# Altium project Spider.PrjPcb
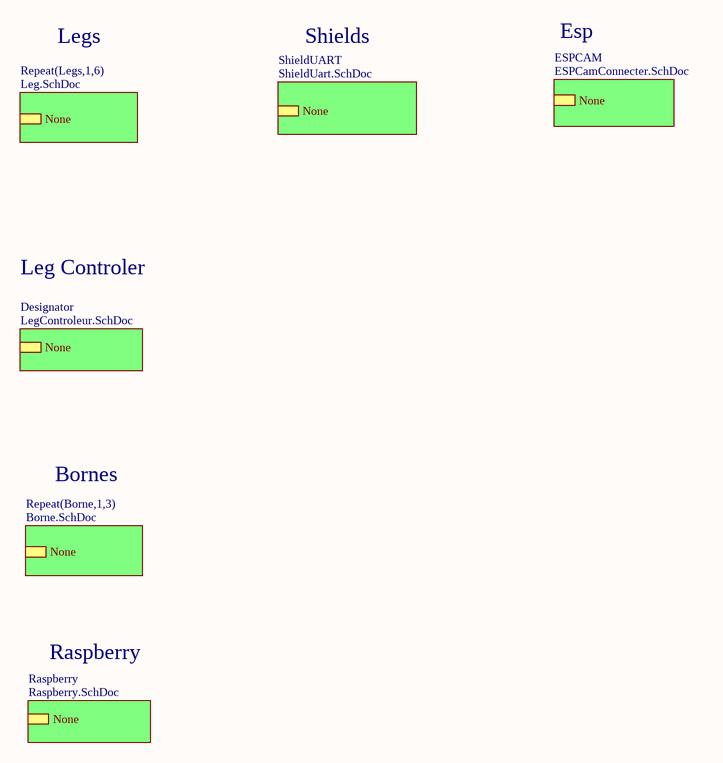
[diagram p0: MainSchema.SchDoc]
4 sheets, 30 parts. Net scope: hierarchical (ports join the sheet entries above them; power ports are global).
Board file: MainPCB.PcbDoc
Sheets:
  MainSchema.SchDoc
    Designator = LegControleur.SchDoc
    Raspberry = Raspberry.SchDoc
    ESPCAM = ESPCamConnecter.SchDoc

## Sheet MainSchema.SchDoc
size A4

### Sub-sheets
Designator = LegControleur.SchDoc: None
ESPCAM = ESPCamConnecter.SchDoc: None
Raspberry = Raspberry.SchDoc: None
Repeat(Borne,1,3) = Borne.SchDoc (file not in this document): None
Repeat(Legs,1,6) = Leg.SchDoc (file not in this document): None
ShieldUART = ShieldUart.SchDoc (file not in this document): None

### Notes on the sheet
- Legs
- Shields
- Esp
- Leg Controler
- Bornes
- Raspberry

## Sheet LegControleur.SchDoc
size A4
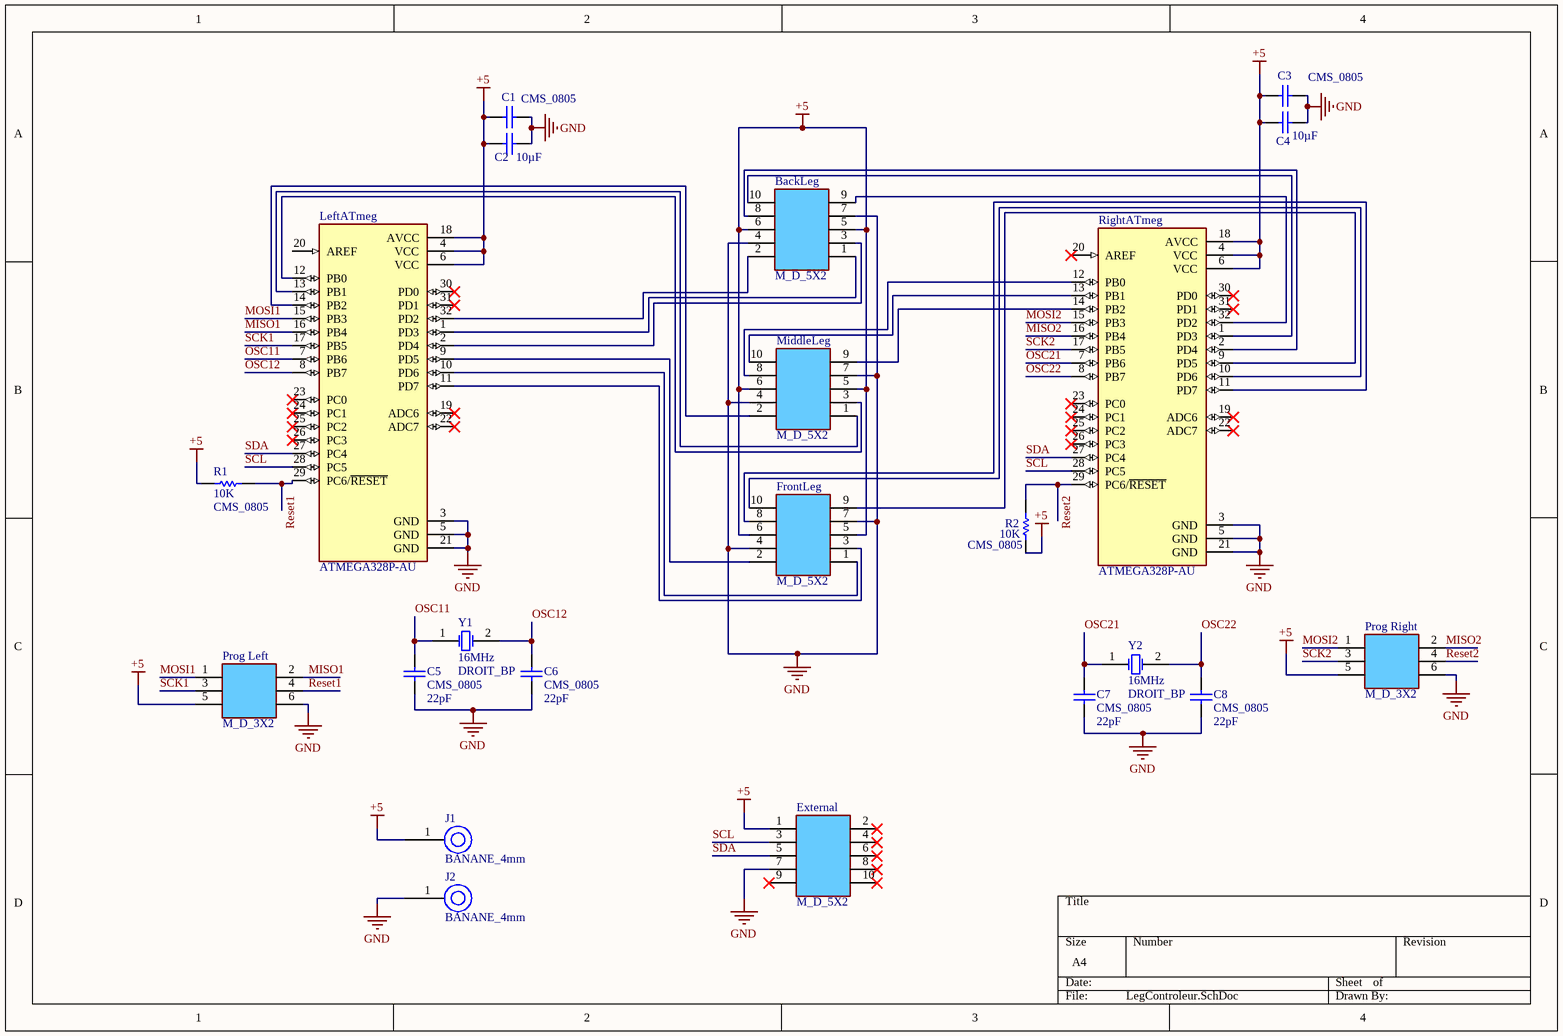
[diagram p1: LegControleur.SchDoc]

### Parts
BackLeg  Type: M_D_5X2  [BARRETTE_5X2_M_D]  (hidden comment: BARRETTE_5 CONTACTS_2 RANGEES_MALE_DROITE)
C1  value 10µF  Type: CMS_0805  [CONDENSATEUR_CMS_0805]  (hidden comment: CMS_0805_AVCC)
C2  CMS_0805_VCC  [CONDENSATEUR_CMS_0805]  (value not drawn)
C3  value 10µF  Type: CMS_0805  [CONDENSATEUR_CMS_0805]  (hidden comment: CMS_0805_AVCC)
C4  CMS_0805_VCC  [CONDENSATEUR_CMS_0805]  (value not drawn)
C5  value 22pF  [CONDENSATEUR_CMS_0805]  (hidden comment: CMS_0805)
C6  value 22pF  [CONDENSATEUR_CMS_0805]  (hidden comment: CMS_0805)
C7  value 22pF  [CONDENSATEUR_CMS_0805]  (hidden comment: CMS_0805)
C8  value 22pF  [CONDENSATEUR_CMS_0805]  (hidden comment: CMS_0805)
External  Type: M_D_5X2  [BARRETTE_5X2_M_D]  (hidden comment: BARRETTE_5 CONTACTS_2 RANGEES_MALE_DROITE)
FrontLeg  Type: M_D_5X2  [BARRETTE_5X2_M_D]  (hidden comment: BARRETTE_5 CONTACTS_2 RANGEES_MALE_DROITE)
J1  Type: BANANE_4mm  [DOUILLE_BANANE_4mm]  (hidden comment: Alim 5v)
J2  Type: BANANE_4mm  [DOUILLE_BANANE_4mm]  (hidden comment: Alim GND)
LeftATmeg  ATMEGA328P-AU  [QFP80P900X900X120-32N]
MiddleLeg  Type: M_D_5X2  [BARRETTE_5X2_M_D]  (hidden comment: BARRETTE_5 CONTACTS_2 RANGEES_MALE_DROITE)
Prog_Left  Type: M_D_3X2  [BARRETTE_3X2_M_D]  (hidden comment: BARRETTE_3 CONTACTS_2 RANGEES_MALE_DROITE)
Prog_Right  Type: M_D_3X2  [BARRETTE_3X2_M_D]  (hidden comment: BARRETTE_3 CONTACTS_2 RANGEES_MALE_DROITE)
R1  value 10K  Type: CMS_0805  [RESISTANCE_CMS_0805]  (hidden comment: RESISTANCE_CMS_0805)
R2  value 10K  Type: CMS_0805  [RESISTANCE_CMS_0805]  (hidden comment: RESISTANCE_CMS_0805)
RightATmeg  ATMEGA328P-AU  [QFP80P900X900X120-32N]
Y1  value 16MHz  Type: DROIT_BP  [QUARTZ_DROIT_BP]  (hidden comment: QUARTZ_DROIT_BAS_PROFIL)
Y2  value 16MHz  Type: DROIT_BP  [QUARTZ_DROIT_BP]  (hidden comment: QUARTZ_DROIT_BAS_PROFIL)

### Nets
+5: BackLeg.5 BackLeg.6 C1.2 C2.2 C3.2 C4.2 External.1 FrontLeg.5 FrontLeg.6 J1.1 LeftATmeg.4(VCC) LeftATmeg.6(VCC) LeftATmeg.18(AVCC) MiddleLeg.5 MiddleLeg.6 Prog_Left.5 Prog_Right.5 R1.1 R2.1 RightATmeg.4(VCC) RightATmeg.6(VCC) RightATmeg.18(AVCC)
GND: BackLeg.4 BackLeg.7 C1.1 C2.1 C3.1 C4.1 C5.1 C6.1 C7.1 C8.1 External.7 FrontLeg.4 FrontLeg.7 J2.1 LeftATmeg.3(GND) LeftATmeg.5(GND) LeftATmeg.21(GND) MiddleLeg.4 MiddleLeg.7 Prog_Left.6 Prog_Right.6 RightATmeg.3(GND) RightATmeg.5(GND) RightATmeg.21(GND)
MISO1: LeftATmeg.16(PB4) Prog_Left.2
MISO2: Prog_Right.2 RightATmeg.16(PB4)
MOSI1: LeftATmeg.15(PB3) Prog_Left.1
MOSI2: Prog_Right.1 RightATmeg.15(PB3)
OSC11: C5.2 LeftATmeg.7(PB6) Y1.1(OSC1)
OSC12: C6.2 LeftATmeg.8(PB7) Y1.2(OSC2)
OSC21: C7.2 RightATmeg.7(PB6) Y2.1(OSC1)
OSC22: C8.2 RightATmeg.8(PB7) Y2.2(OSC2)
Reset1: LeftATmeg.29(PC6/~{RESET}) Prog_Left.4 R1.2
Reset2: Prog_Right.4 R2.2 RightATmeg.29(PC6/~{RESET})
SCK1: LeftATmeg.17(PB5) Prog_Left.3
SCK2: Prog_Right.3 RightATmeg.17(PB5)
SCL: External.3 LeftATmeg.28(PC5) RightATmeg.28(PC5)
SDA: External.5 LeftATmeg.27(PC4) RightATmeg.27(PC4)
NetBackLeg_1: BackLeg.1 LeftATmeg.1(PD3)
NetBackLeg_2: BackLeg.2 LeftATmeg.32(PD2)
NetBackLeg_3: BackLeg.3 LeftATmeg.2(PD4)
NetBackLeg_8: BackLeg.8 RightATmeg.2(PD4)
NetBackLeg_9: BackLeg.9 RightATmeg.32(PD2)
NetBackLeg_10: BackLeg.10 RightATmeg.1(PD3)
NetFrontLeg_1: FrontLeg.1 LeftATmeg.10(PD6)
NetFrontLeg_2: FrontLeg.2 LeftATmeg.9(PD5)
NetFrontLeg_3: FrontLeg.3 LeftATmeg.11(PD7)
NetFrontLeg_8: FrontLeg.8 RightATmeg.11(PD7)
NetFrontLeg_9: FrontLeg.9 RightATmeg.9(PD5)
NetFrontLeg_10: FrontLeg.10 RightATmeg.10(PD6)
NetLeftATmeg_12: LeftATmeg.12(PB0) MiddleLeg.3
NetLeftATmeg_13: LeftATmeg.13(PB1) MiddleLeg.1
NetLeftATmeg_14: LeftATmeg.14(PB2) MiddleLeg.2
NetMiddleLeg_8: MiddleLeg.8 RightATmeg.12(PB0)
NetMiddleLeg_9: MiddleLeg.9 RightATmeg.14(PB2)
NetMiddleLeg_10: MiddleLeg.10 RightATmeg.13(PB1)

Not connected (* = marked no-connect by the designer): External 2* 4* 6* 8* 9* 10*; LeftATmeg 19(ADC6)* 20(AREF) 22(ADC7)* 23(PC0)* 24(PC1)* 25(PC2)* 26(PC3)* 30(PD0)* 31(PD1)*; RightATmeg 19(ADC6)* 20(AREF)* 22(ADC7)* 23(PC0)* 24(PC1)* 25(PC2)* 26(PC3)* 30(PD0)* 31(PD1)*

### Library data of the parts
BackLeg External FrontLeg MiddleLeg = BARRETTE_5 CONTACTS_2 RANGEES_MALE_DROITE: BARRETTE 5 CONTACTS 2 RANGEES MALE DROITE
C1 C3 C5-C8 = CONDENSATEUR_CMS_CER_0805: CONDENSATEUR CMS CERAMIQUE 0805
  C5-C8: Type: CMS_0805
C2 C4 = CONDENSATEUR_CMS_CER_0805: CONDENSATEUR CMS CERAMIQUE 0805; Value: 10µF; Type: CMS_0805
J1 J2 = DOUILLE_BANANE_4mm: DOUILLE BANANE 4 mm
LeftATmeg RightATmeg = ATMEGA328P-AU: AVR AVRÂ® ATmega Microcontroller IC 8-Bit 20MHz 32KB (16K x 16) FLASH 32-TQFP (7x7); MF: Microchip Technology; Value: *; SnapEDA_Link: https://www.snapeda.com/parts/ATMEGA328P-AU/Microchip/view-part/?ref=snap; MP: ATMEGA328P-AU; Purchase-URL: https://pricing.snapeda.com/search/part/ATMEGA328P-AU/?ref=eda; Check_prices: https://www.snapeda.com/parts/ATMEGA328P-AU/Microchip/view-part/?ref=eda; Availability: In Stock; Price: None; Package: TQFP-32 Microchip
Prog_Left Prog_Right = BARRETTE_3 CONTACTS_2 RANGEES_MALE_DROITE: BARRETTE 3 CONTACTS 2 RANGEES MALE DROITE
R1 R2 = RESISTANCE_CMS_0805: RESISTANCE CMS 0805
Y1 Y2 = QUARTZ_DROIT_BAS_PROFIL: QUARTZ DROIT BAS PROFIL

## Sheet Raspberry.SchDoc
size A4
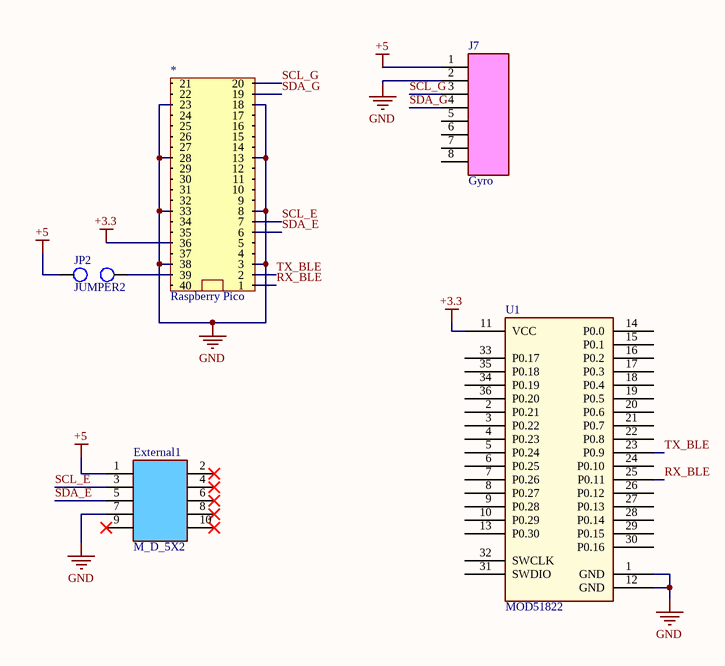
[diagram p2: Raspberry.SchDoc]

### Parts
(Parts that share a designator on the sheet are numbered #1, #2 ... from top to bottom, then left to right.)
*#1  Raspberry Pico  [Raspberry Pico]
External1  Type: M_D_5X2  [BARRETTE_5X2_M_D]  (hidden comment: BARRETTE_5 CONTACTS_2 RANGEES_MALE_DROITE)
J7  Type: Gyro  [BARRETTE_8_F_D]  (hidden comment: BARRETTE_8 CONTACTS_1 RANGEE_FEMELLE_DROITE)
JP2  JUMPER2  [BARRETTE_2_M_D]
U1  MOD51822  [MOD51822]

### Nets
+3.3: *#1.36 U1.11(VCC)
+5: External1.1 J7.1 JP2.1
GND: *#1.3 *#1.8 *#1.13 *#1.18 *#1.23 *#1.28 *#1.33 *#1.38 External1.7 J7.2 U1.1(GND) U1.12(GND)
RX_BLE: *#1.1 U1.25(P0.11)
SCL_E: *#1.7 External1.3
SCL_G: *#1.20 J7.3
SDA_E: *#1.6 External1.5
SDA_G: *#1.19 J7.4
TX_BLE: *#1.2 U1.23(P0.9)
Net*#1_39: *#1.39 JP2.2

Not connected (* = marked no-connect by the designer): *#1 4 5 9 10 11 12 14 15 16 17 21 22 24 25 26 27 29 30 31 32 34 35 37 40; External1 2* 4* 6* 8* 9* 10*; J7 5 6 7 8; U1 2(P0.21) 3(P0.22) 4(P0.23) 5(P0.24) 6(P0.25) 7(P0.26) 8(P0.27) 9(P0.28) 10(P0.29) 13(P0.30) 14(P0.0) 15(P0.1) 16(P0.2) 17(P0.3) 18(P0.4) 19(P0.5) 20(P0.6) 21(P0.7) 22(P0.8) 24(P0.10) 26(P0.12) 27(P0.13) 28(P0.14) 29(P0.15) 30(P0.16) 31(SWDIO) 32(SWCLK) 33(P0.17) 34(P0.19) 35(P0.18) 36(P0.20)

### Library data of the parts
External1 = BARRETTE_5 CONTACTS_2 RANGEES_MALE_DROITE: as BackLeg on sheet LegControleur
JP2 = JUMPER2: BARRETTE 2 CONTACTS 1 RANGEE MALE DROITE; Type: JUMPER2

## Sheet ESPCamConnecter.SchDoc
size A4
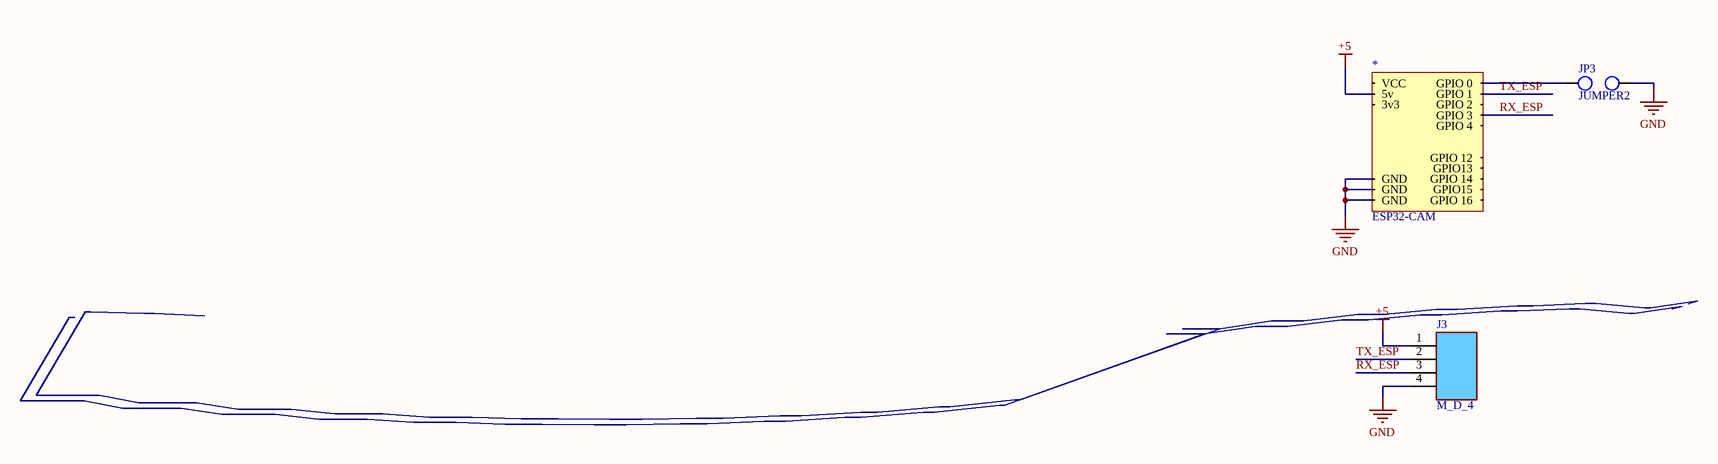
[diagram p3: ESPCamConnecter.SchDoc]

### Parts
(Parts that share a designator on the sheet are numbered #1, #2 ... from top to bottom, then left to right.)
*#2  ESP32-CAM  [ESP32-CAM]
J3  Type: M_D_4  [BARRETTE_4_M_D]  (hidden comment: BARRETTE_4 CONTACTS_1 RANGEE_MALE_DROITE)
JP3  JUMPER2  [BARRETTE_2_M_D]

### Nets
+5: *#2.9(5v) J3.1
GND: *#2.4(GND) *#2.8(GND) *#2.10(GND) J3.4 JP3.2
RX_ESP: *#2.6(GPIO_3) J3.3
TX_ESP: *#2.7(GPIO_1) J3.2
Net*#2_3: *#2.3(GPIO_0) JP3.1

Not connected (* = marked no-connect by the designer): *#2 1(3v3) 2(GPIO_16) 5(VCC) 11(GPIO_12) 12(GPIO13) 13(GPIO15) 14(GPIO_14) 15(GPIO_2) 16(GPIO_4)

### Library data of the parts
J3 = BARRETTE_4 CONTACTS_1 RANGEE_MALE_DROITE: BARRETTE 4 CONTACTS 1 RANGEE MALE DROITE
JP3 = JUMPER2: BARRETTE 2 CONTACTS 1 RANGEE MALE DROITE; Type: JUMPER2

## Nets that join several sheets
+5: LegControleur (22 pins), Raspberry (External1.1 J7.1 JP2.1), ESPCamConnecter (*#2.9 J3.1)
GND: LegControleur (24 pins), Raspberry (12 pins), ESPCamConnecter (5 pins)